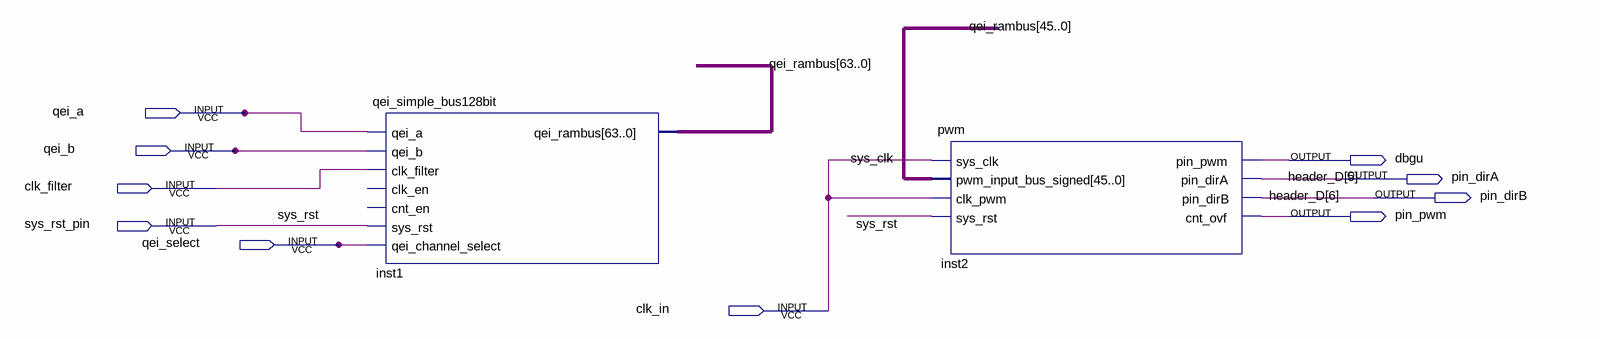
[diagram p0: schematic sheet]
// Quartus schematic qei_pwm_block.bdf as structural Verilog: 2 symbols, 10 pins
module qei_pwm_block (
  input  qei_a,
  input  qei_b,
  input  clk_filter,
  input  sys_rst_pin,
  input  qei_select,
  input  clk_in,
  output dbgu,
  output pin_dirA,
  output pin_dirB,
  output pin_pwm
);

  wire [63:0] qei_rambus;

  qei_simple_bus128bit inst1 (
    .qei_a(qei_a), .qei_b(qei_b), .clk_filter(clk_filter), .sys_rst(sys_rst_pin),
    .qei_channel_select(qei_select), .qei_rambus(qei_rambus));  // open: clk_en, cnt_en
  pwm inst2 (
    .sys_clk(clk_in), .pwm_input_bus_signed(qei_rambus[45:0]), .clk_pwm(clk_in), .sys_rst(sys_rst_pin),
    .pin_pwm(dbgu), .pin_dirA(pin_dirA), .pin_dirB(pin_dirB), .cnt_ovf(pin_pwm));

  // Other names for the same wires on the sheet: header_D[6:5] = {pin_dirB, pin_dirA}; sys_clk = clk_in;
  //   sys_rst = sys_rst_pin
endmodule
